# EAGLE schematic RemoconCar (EAGLE 5.11)
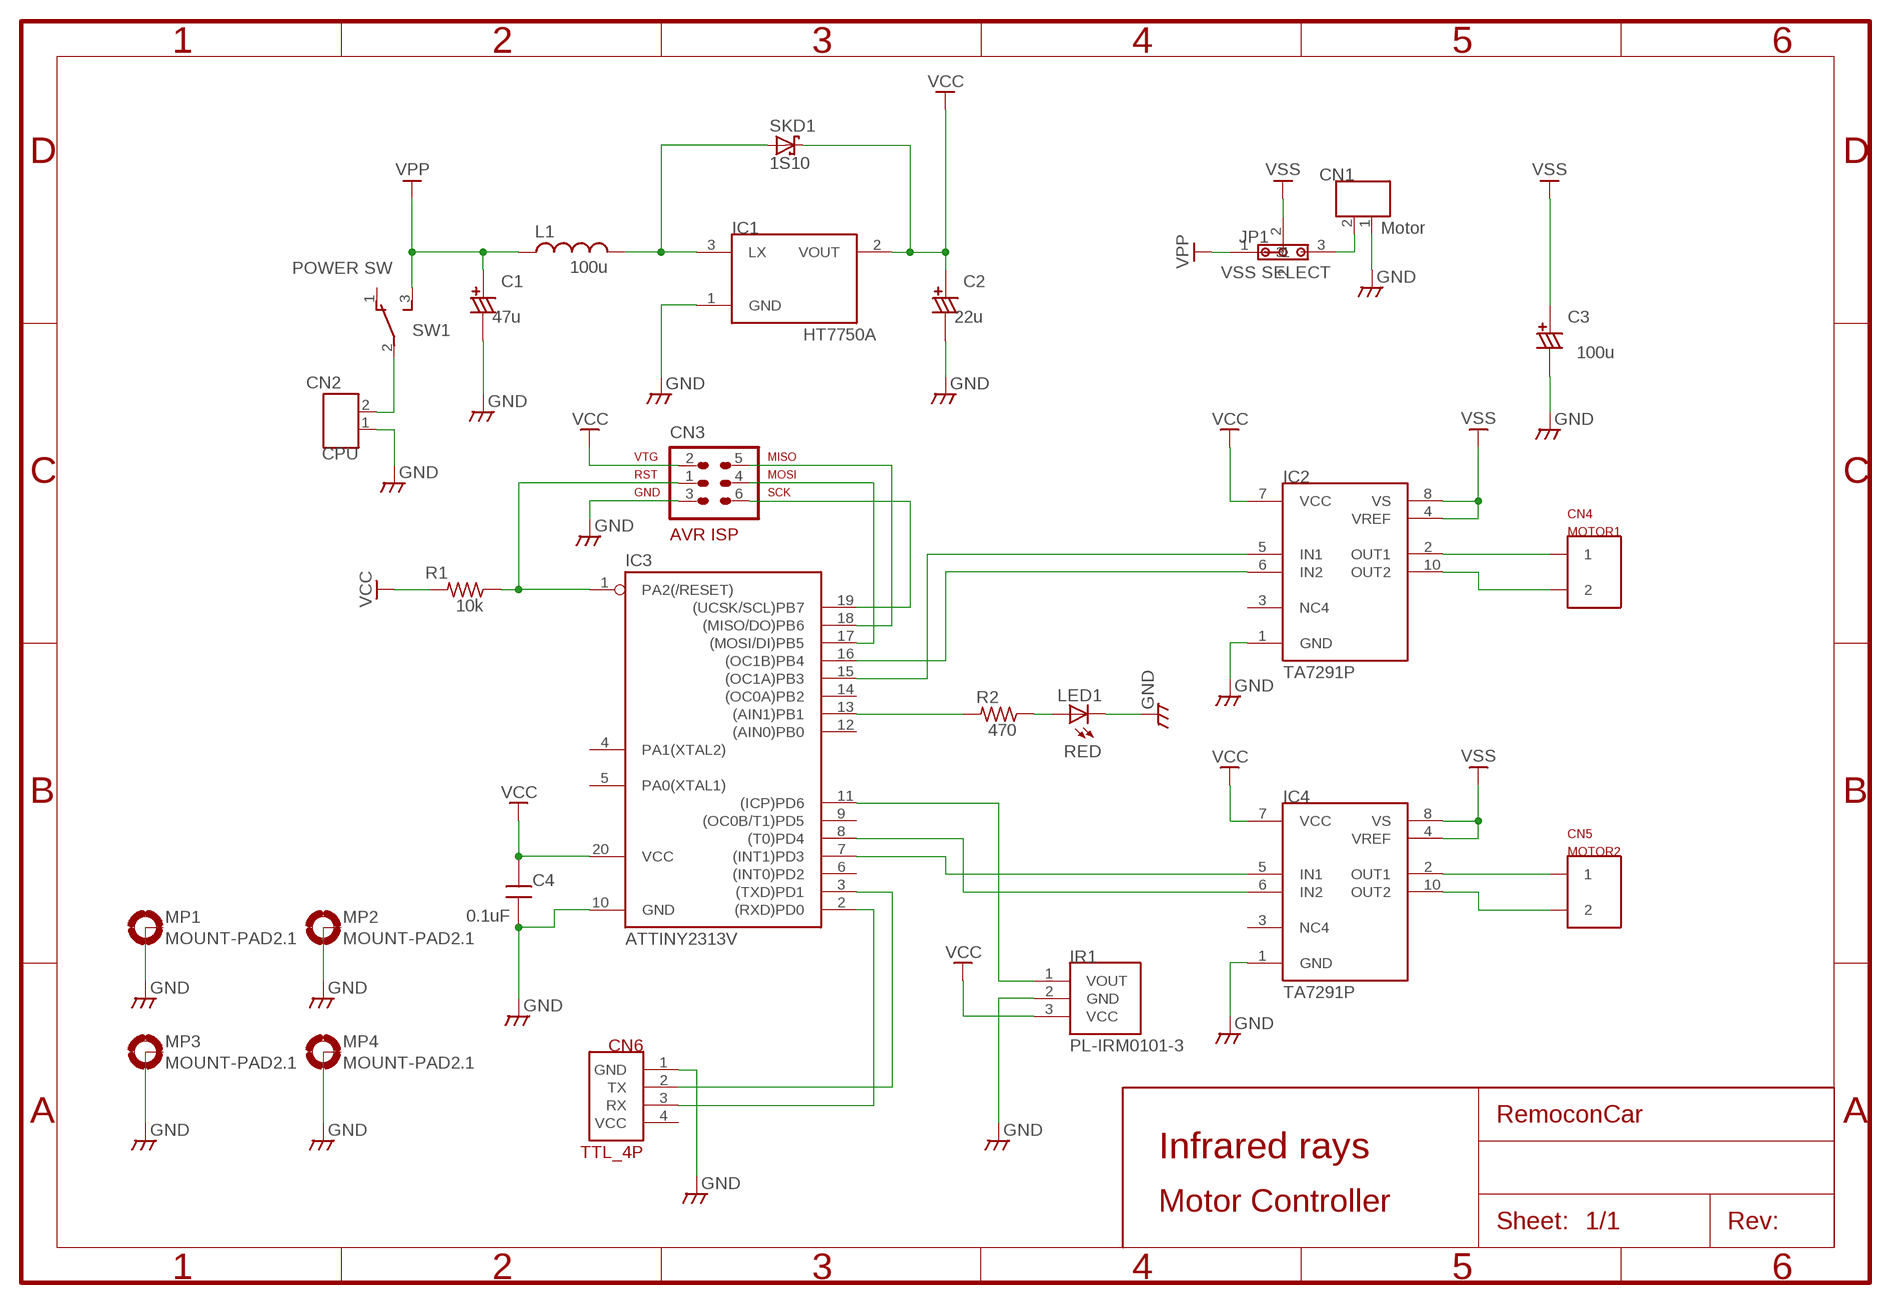
[diagram p0: schematic, sheet 1]

## Parts
C1  47u  CCAP6.5  [CCAP_6.5]
C2  22u  CCAP6.5  [CCAP_6.5]
C3  100u  CCAP6.5  [CCAP_6.5]
C4  0.1uF  CAPDIP_2  [CAP_DIP_2]
CN1  Motor  CON_2P  [CON_HRS_DIP_2]
CN2  CPU  CON_2P  [CON_HRS_DIP_2]
CN3  AVR-ISP-6  AVR-ISP-6F  [AVR-ISP-6-FLAT]
CN4  MOTOR1  TERMINAL  [TERMINAL]
CN5  MOTOR2  TERMINAL  [TERMINAL]
CN6  TTL_4P  [CON_HRS_DIP_4]
IC1  HT7750A  [TO92_TRI]
IC2  TA7291P  [HSIP10]
IC3  ATTINY2313V  TINY2313-*P*  [DIL20]
IC4  TA7291P  [HSIP10]
IR1  PL-IRM0101-3  PL-IRM0208  [PL-IRM0208]
JP1  VSS SELECT  JUMPER_3P  [CSTLS]
L1  100u  L-US0207/7  [0207/7]
LED1  RED  LED3MM  [LED3MM]
MP1  MOUNT-PAD2.1  [PAD-2.1]
MP2  MOUNT-PAD2.1  [PAD-2.1]
MP3  MOUNT-PAD2.1  [PAD-2.1]
MP4  MOUNT-PAD2.1  [PAD-2.1]
R1  10k  R0.125W_4P  [R_0.125W_4]
R2  470  R0.125W_4P  [R_0.125W_4]
SKD1  1S10  [R-1]
SW1  POWER SW  SLIDESW-3  [DS-3]

## Nets
GND: C1.- C2.- C3.- C4.1 CN1.1 CN2.1 CN3.3 CN6.1(GND) IC1.1(GND) IC2.1(GND) IC3.10(GND) IC4.1(GND) IR1.2(GND) LED1.K(C) MP1.B2,1(MOUNT) MP2.B2,1(MOUNT) MP3.B2,1(MOUNT) MP4.B2,1(MOUNT)
N$1: IC3.11((ICP)PD6) IR1.1(VOUT)
N$2: LED1.A R2.1
N$4: IC2.5(IN1) IC3.15((OC1A)PB3)
N$5: IC3.13((AIN1)PB1) R2.2
N$6: IC1.3(LX) L1.2 SKD1.1-A(A)
N$7: IC2.6(IN2) IC3.16((OC1B)PB4)
N$8: IC3.7((INT1)PD3) IC4.5(IN1)
N$9: IC3.8((T0)PD4) IC4.6(IN2)
N$10: CN5.P$1 IC4.2(OUT1)
N$11: CN5.P$2 IC4.10(OUT2)
N$12: CN4.P$1 IC2.2(OUT1)
N$13: CN4.P$2 IC2.10(OUT2)
N$14: CN3.1 IC3.1(PA2(/RESET)) R1.1
N$16: CN6.2(TX) IC3.3((TXD)PD1)
N$17: CN2.2 SW1.2(P)
N$18: CN6.3(RX) IC3.2((RXD)PD0)
N$21: CN3.4 IC3.17((MOSI/DI)PB5)
N$22: CN3.5 IC3.18((MISO/DO)PB6)
N$23: CN3.6 IC3.19((UCSK/SCL)PB7)
N$24: CN1.2 JP1.3
VCC: C2.+ C4.2 CN3.2 IC1.2(VOUT) IC2.7(VCC) IC3.20(VCC) IC4.7(VCC) IR1.3(VCC) R1.2 SKD1.2-K(K)
VPP: C1.+ JP1.1 L1.1 SW1.3(S)
VSS: C3.+ IC2.4(VREF) IC2.8(VS) IC4.4(VREF) IC4.8(VS) JP1.2
Unconnected: IC2.3(NC4) IC3.4(PA1(XTAL2)) IC3.5(PA0(XTAL1)) IC3.6((INT0)PD2) IC3.9((OC0B/T1)PD5) IC3.12((AIN0)PB0) IC3.14((OC0A)PB2) IC4.3(NC4) SW1.1(O)

## Notes on the sheet
- Infrared rays
- Motor Controller

## Power pins joined to a net without a drawn wire
VCC: CN6.4(VCC)

## Library data of the parts
C1-C3 = MyLib:CCAP: Polar capacitor
C4 = MyLib:CAP: Non polar capacitor
CN1 CN2 = MyLib:CON_2P: 2P Molex Connector
CN3 = bant:AVR-ISP-6: AVR ISP-6 Serial Programming Header
CN4 CN5 = bant:TERMINAL
CN6 = bant:TTL_4P
IC1 = keinSoft-01:HT7750A: PFM Step-up DC/DC Converter HT7750A Input: 0.7V ~ , Output: 5.0V
IC2 IC4 = TA7291P:TA7291*: DC Motor Bridge driver TOSHIBA TA7291S/SG SIP9-P-2.54A 0.4A(AVE), 1.2A(PEAK)
IC3 = atmel:TINY2313*: Atmel Tiny2313 2K Flash, 128 bytes EEPROM, 128 bytes RAM
IR1 = keinSoft-01:PL-IRM0208: IR Reciever module 38kHz Vcc= 4.5-5.5V
JP1 = MyLib:JUMPER_3P: Jumper 3P
L1 = rcl:L-US: INDUCTOR, American symbol
LED1 = led:LED: LED OSRAM: - CHIPLED LG R971, LG N971, LY N971, LG Q971, LY Q971, LO R971, LY R971 LH N974, LH R974 LS Q976, LO Q976, LY Q976 LO Q996 - Hyper CHIPLED LW Q18S LB Q993, LB Q99A, LB R99A - SideLED LS A670, LO A670, LY A670, LG A670, LP A670 LB A673, LV A673, LT A673, LW A673 LH A674 LY A675 LS A676, LA A676, LO A676, LY A676, LW A676 LS A679, LY A679, LG A679 - Hyper Micro SIDELEDR LS Y876, LA Y876, LO Y876, LY Y876 LT Y87S - SmartLED LW L88C, LW L88S LB L89C, LB L89S, LG L890 LS L89K, LO L89K, LY L89K LS L896, LA L896, LO L896, LY L896 - TOPLED LS T670, LO T670, LY T670, LG T670, LP T670 LSG T670, LSP T670, LSY T670, LOP T670, LYG T670 LG T671, LOG T671, LSG T671 LB T673, LV T673, LT T673, LW T673 LH T674 LS T676, LA T676, LO T676, LY T676, LB T676, LH T676, LSB T676, LW T676 LB T67C, LV T67C, LT T67C, LS T67K, LO T67K, LY T67K, LW E67C LS E67B, LA E67B, LO E67B, LY E67B, LB E67C, LV E67C, LT E67C LW T67C LS T679, LY T679, LG T679 LS T770, LO T770, LY T770, LG T770, LP T770 LB T773, LV T773, LT T773, LW T773 LH T774 LS E675, LA E675, LY E675, LS T675 LS T776, LA T776, LO T776, LY T776, LB T776 LHGB T686 LT T68C, LB T68C - Hyper Mini TOPLEDR LB M676 - Mini TOPLED SantanaR LG M470 LS M47K, LO M47K, LY M47K Source: http://www.osram.convergy.de LUXEON: - LUMILEDR LXK2-PW12-R00, LXK2-PW12-S00, LXK2-PW14-U00, LXK2-PW14-V00 LXK2-PM12-R00, LXK2-PM12-S00, LXK2-PM14-U00 LXK2-PE12-Q00, LXK2-PE12-R00, LXK2-PE12-S00, LXK2-PE14-T00, LXK2-PE14-U00 LXK2-PB12-K00, LXK2-PB12-L00, LXK2-PB12-M00, LXK2-PB14-N00, LXK2-PB14-P00, LXK2-PB14-Q00 LXK2-PR12-L00, LXK2-PR12-M00, LXK2-PR14-Q00, LXK2-PR14-R00 LXK2-PD12-Q00, LXK2-PD12-R00, LXK2-PD12-S00 LXK2-PH12-R00, LXK2-PH12-S00 LXK2-PL12-P00, LXK2-PL12-Q00, LXK2-PL12-R00 Source: www.luxeon.com KINGBRIGHT: KA-3528ASYC Source: www.kingbright.com
MP1-MP4 = MyLib:MOUNT-PAD: 2.1mm Mount Pad (Connectable to GND)
R1 R2 = MyLib:R: General Resiter 1/8W 1/4W 1/2W V/H
SKD1 = keinSoft-01:1S10: Shotkey barrier diode 1S10 100V, 1A
SW1 = MyLib:SLIDESW-3: 3P Slide Switch